# EAGLE design Physio_v1.0 (EAGLE 7.4.0)
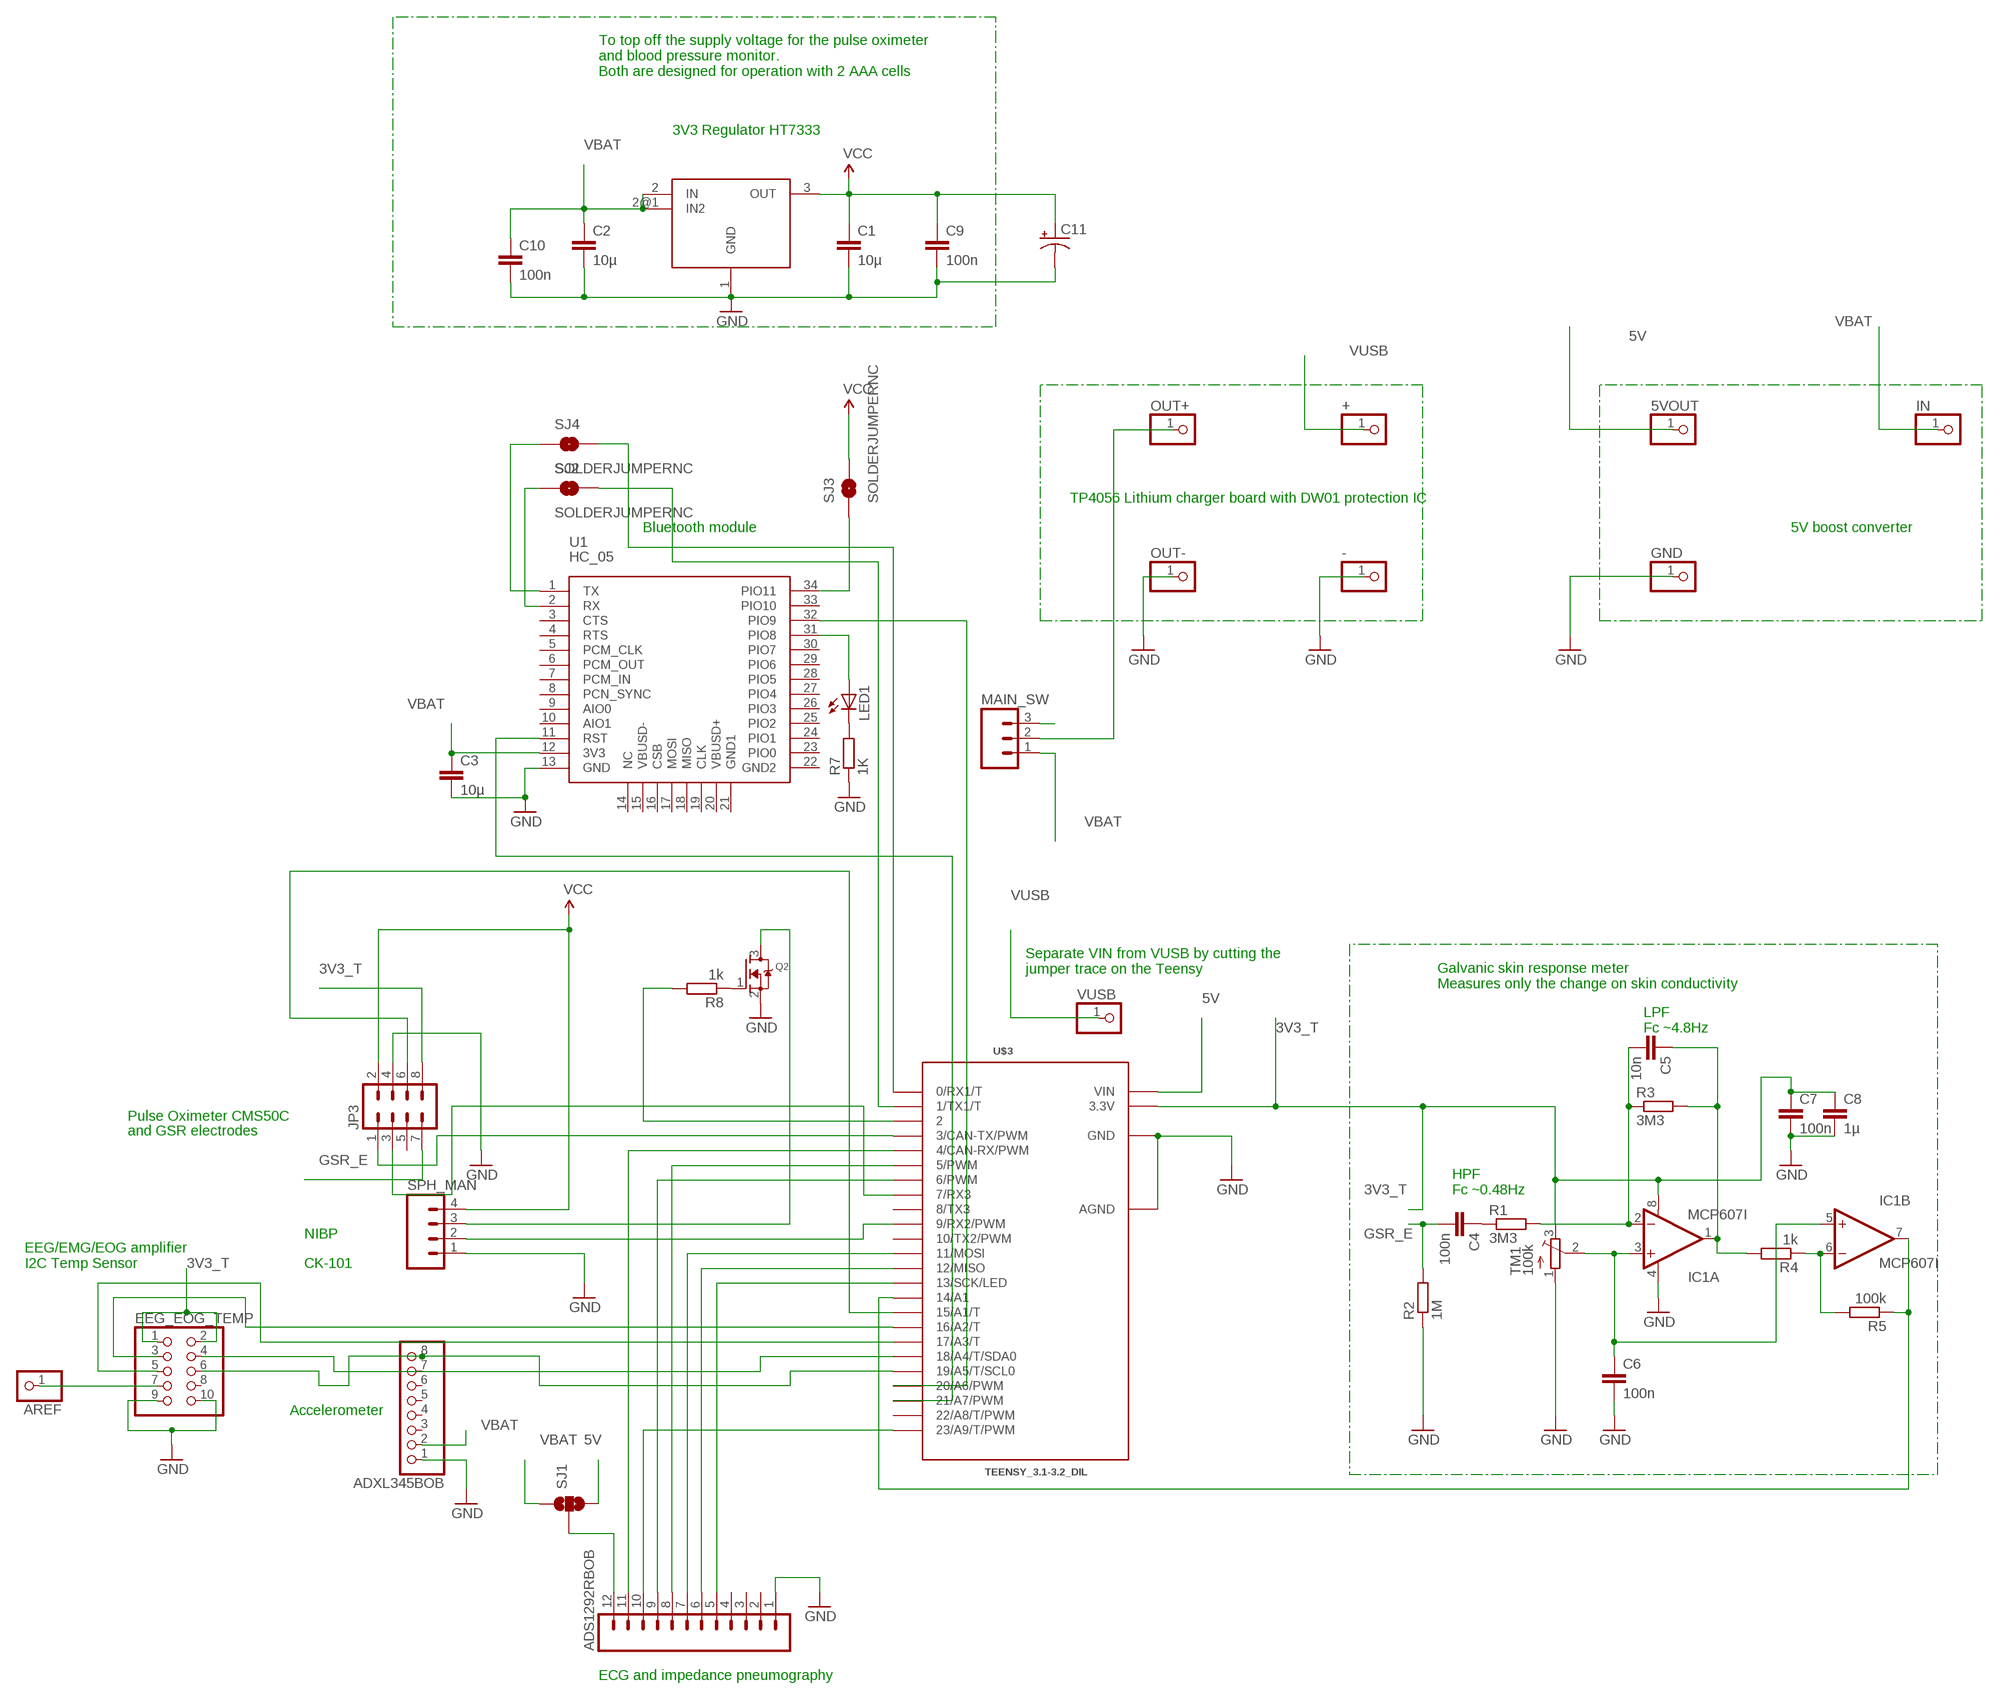
[diagram p0: schematic, sheet 1]

## Parts
5VOUT  PINHD-1X1  [1X01]
+  PINHD-1X1  [1X01]
-  PINHD-1X1  [1X01]
ADS1292RBOB  M12PTH  [1X12]
ADXL345BOB  PINHD-1X8CLEANBIG  [1X08-CLEANBIG]
AREF  PINHD-1X1  [1X01]
C1  10µ  C-EUC0805K  [C0805K]
C2  10µ  C-EUC0805K  [C0805K]
C3  10µ  C-EUC0805K  [C0805K]
C4  100n  C-EUC0603K  [C0603K]
C5  10n  C-EUC0603K  [C0603K]
C6  100n  C-EUC0603K  [C0603K]
C7  100n  C-EUC0603K  [C0603K]
C8  1µ  C-EUC0603K  [C0603K]
C9  100n  C-EUC0603K  [C0603K]
C10  100n  C-EUC0603K  [C0603K]
C11  CAP_POL7343  [EIA7343]
EEG_EOG_TEMP  PINHD-2X5/90  [2X05/90]
GND  PINHD-1X1  [1X01]
IC1  MCP607I  OPAMP-DUALU  [SO08]
IN  PINHD-1X1  [1X01]
JP3  M04X2  [2X4]
LED1  LEDCHIP-LED0805  [CHIP-LED0805]
MAIN_SW  M03PTH  [1X03]
OUT+  PINHD-1X1  [1X01]
OUT-  PINHD-1X1  [1X01]
Q2  MOSFET-NREFLOW  [SOT23]
R1  3M3  R-EU_R0603  [R0603]
R2  1M  R-EU_R0603  [R0603]
R3  3M3  R-EU_R0603  [R0603]
R4  1k  R-EU_R0603  [R0603]
R5  100k  R-EU_R0603  [R0603]
R7  1K  R-EU_R0603  [R0603]
R8  1k  R-EU_R0603  [R0603]
SJ1  SOLDERJUMPER_2WAY-OLDT  [SJ_2]
SJ2  SOLDERJUMPERNC  [SJ_2S]
SJ3  SOLDERJUMPERNC  [SJ_2S]
SJ4  SOLDERJUMPERNC  [SJ_2S]
SPH_MAN  M04PTH  [1X04]
TM1  100k  TRIMPOTTC33X  [TC33X]
U1  HC_05  [BLUETOOTH_SMD]
U$2  HT7333  [SOT89]
U$3  TEENSY_3.1-3.2_DIL  [TEENSY_3.0-3.2&LC_DIL]
VUSB  PINHD-1X1  [1X01]

## Nets
3V3_T: C7.1 C8.1 EEG_EOG_TEMP.1 EEG_EOG_TEMP.2 IC1.8(A:V+) JP3.8 TM1.3(E) U$3.3.3V
5V: 5VOUT.1 SJ1.3 U$3.VIN
GND: -.1 ADS1292RBOB.1 ADXL345BOB.1 C1.2 C2.2 C3.2 C6.2 C7.2 C8.2 C9.2 C10.2 C11.C(-) EEG_EOG_TEMP.9 EEG_EOG_TEMP.10 GND.1 IC1.4(A:V-) JP3.4 OUT-.1 Q2.2(S) R2.1 R7.1 SPH_MAN.1 TM1.1(A) U1.13(GND) U$2.1(GND) U$3.AGND U$3.GND
GSR_E: C4.2 JP3.7 R2.2
N$1: JP3.1 U$3.3(3/CAN-TX/PWM)
N$2: SPH_MAN.2 U$3.9(9/RX2/PWM)
N$3: JP3.3 U$3.7(7/RX3)
N$4: Q2.3(D) SPH_MAN.3
N$5: SJ4.2 U$3.0(0/RX1/T)
N$6: SJ2.2 U$3.1(1/TX1/T)
N$7: MAIN_SW.3
N$8: ADS1292RBOB.7 U$3.11(11/MOSI)
N$9: ADS1292RBOB.6 U$3.12(12/MISO)
N$10: ADS1292RBOB.5 U$3.13(13/SCK/LED)
N$11: ADS1292RBOB.9 U$3.6(6/PWM)
N$12: ADS1292RBOB.8 U$3.5(5/PWM)
N$13: ADS1292RBOB.11 U$3.4(4/CAN-RX/PWM)
N$14: ADS1292RBOB.10 U$3.23/A9(23/A9/T/PWM)
N$15: C5.2 IC1.2(A:-IN) R1.2 R3.1
N$16: C5.1 IC1.1(A:OUT) R3.2 R4.2
N$17: C6.1 IC1.3(A:+IN) IC1.5(B:+IN) TM1.2(S)
N$18: C4.1 R1.1
N$19: SJ4.1 U1.1(TX)
N$20: IC1.6(B:-IN) R4.1 R5.2
N$21: IC1.7(B:OUT) R5.1 U$3.14/A0(14/A1)
N$22: SJ2.1 U1.2(RX)
N$23: JP3.6 U$3.15/A1(15/A1/T)
N$25: ADXL345BOB.8 EEG_EOG_TEMP.6 U$3.19/A5(19/A5/T/SCL0)
N$26: ADXL345BOB.7 EEG_EOG_TEMP.4 U$3.18/A4(18/A4/T/SDA0)
N$27: LED1.C R7.2
N$28: LED1.A U1.31(PIO8)
N$29: EEG_EOG_TEMP.3 U$3.16/A2(16/A2/T)
N$30: EEG_EOG_TEMP.5 U$3.17/A3(17/A3/T)
N$31: R8.2 U$3.2
N$33: ADS1292RBOB.12 SJ1.2
N$36: Q2.1(G) R8.1
N$37: AREF.1 EEG_EOG_TEMP.7
N$38: MAIN_SW.2 OUT+.1
N$39: U1.32(PIO9) U$3.20/A6(20/A6/PWM)
N$40: U1.11(RST) U$3.21/A7(21/A7/PWM)
N$41: SJ3.1 U1.34(PIO11)
VBAT: ADXL345BOB.2 C2.1 C3.1 C10.1 IN.1 MAIN_SW.1 SJ1.1 U1.12(3V3) U$2.2(IN) U$2.2@1(IN2)
VCC: C1.1 C9.1 C11.A(+) JP3.2 SJ3.2 SPH_MAN.4 U$2.3(OUT)
VUSB: +.1 VUSB.1
Unconnected: ADS1292RBOB.2 ADS1292RBOB.3 ADS1292RBOB.4 ADXL345BOB.3 ADXL345BOB.4 ADXL345BOB.5 ADXL345BOB.6 EEG_EOG_TEMP.8 JP3.5 U1.3(CTS) U1.4(RTS) U1.5(PCM_CLK) U1.6(PCM_OUT) U1.7(PCM_IN) U1.8(PCN_SYNC) U1.9(AIO0) U1.10(AIO1) U1.14(NC) U1.15(VBUSD-) U1.16(CSB) U1.17(MOSI) U1.18(MISO) U1.19(CLK) U1.20(VBUSD+) U1.21(GND1) U1.22(GND2) U1.23(PIO0) U1.24(PIO1) U1.25(PIO2) U1.26(PIO3) U1.27(PIO4) U1.28(PIO5) U1.29(PIO6) U1.30(PIO7) U1.33(PIO10) U$3.8(8/TX3) U$3.10(10/TX2/PWM) U$3.22/A8(22/A8/T/PWM)

## Notes on the sheet
- To top off the supply voltage for the pulse oximeter 
  and blood pressure monitor. 
  Both are designed for operation with 2 AAA cells
- 3V3 Regulator HT7333
- TP4056 Lithium charger board with DW01 protection IC
- Bluetooth module | 5V boost converter
- Separate VIN from VUSB by cutting the 
  jumper trace on the Teensy
- Galvanic skin response meter
  Measures only the change on skin conductivity
- LPF
  Fc ~4.8Hz
- Pulse Oximeter CMS50C
- and GSR electrodes
- HPF
  Fc ~0.48Hz
- NIBP
- EEG/EMG/EOG amplifier
  I2C Temp Sensor
- CK-101
- Accelerometer
- ECG and impedance pneumography

## Library data of the parts
5VOUT + - GND IN OUT+ OUT- VUSB = adafruit:PINHD-1X1: Pin header 1x1 for 0.1" spacing With round pins
ADS1292RBOB = SparkFun-Connectors:M12: Header 12 Standard 12-pin 0.1" header. Use with straight break away headers (SKU : PRT-00116), right angle break away headers (PRT-00553), swiss pins (PRT-00743), machine pins (PRT-00117), and female headers (PRT-00115).
ADXL345BOB = adafruit:PINHD-1X8: PIN HEADER
AREF = pinhead:PINHD-1X1: PIN HEADER
C1-C10 = rcl:C-EU: CAPACITOR, European symbol
C11 = SparkFun-Passives:CAP_POL: Capacitor Polarized These are standard SMD and PTH capacitors. Normally 10uF, 47uF, and 100uF in electrolytic and tantalum varieties. Always verify the external diameter of the through hole cap, it varies with capacity, voltage, and manufacturer. The EIA devices should be standard.
EEG_EOG_TEMP = pinhead:PINHD-2X5: PIN HEADER
IC1 = SparkFun-AnalogIC:OPAMP-DUAL: Generic op-amp footprint
JP3 = SparkFun-Connectors:M04X2: .1" header, two rows of four.
LED1 = adafruit:LED: LED OSRAM: - CHIPLED LG R971, LG N971, LY N971, LG Q971, LY Q971, LO R971, LY R971 LH N974, LH R974 LS Q976, LO Q976, LY Q976 LO Q996 - Hyper CHIPLED LW Q18S LB Q993, LB Q99A, LB R99A - SideLED LS A670, LO A670, LY A670, LG A670, LP A670 LB A673, LV A673, LT A673, LW A673 LH A674 LY A675 LS A676, LA A676, LO A676, LY A676, LW A676 LS A679, LY A679, LG A679 - Hyper Micro SIDELED® LS Y876, LA Y876, LO Y876, LY Y876 LT Y87S - SmartLED LW L88C, LW L88S LB L89C, LB L89S, LG L890 LS L89K, LO L89K, LY L89K LS L896, LA L896, LO L896, LY L896 - TOPLED LS T670, LO T670, LY T670, LG T670, LP T670 LSG T670, LSP T670, LSY T670, LOP T670, LYG T670 LG T671, LOG T671, LSG T671 LB T673, LV T673, LT T673, LW T673 LH T674 LS T676, LA T676, LO T676, LY T676, LB T676, LH T676, LSB T676, LW T676 LB T67C, LV T67C, LT T67C, LS T67K, LO T67K, LY T67K, LW E67C LS E67B, LA E67B, LO E67B, LY E67B, LB E67C, LV E67C, LT E67C LW T67C LS T679, LY T679, LG T679 LS T770, LO T770, LY T770, LG T770, LP T770 LB T773, LV T773, LT T773, LW T773 LH T774 LS E675, LA E675, LY E675, LS T675 LS T776, LA T776, LO T776, LY T776, LB T776 LHGB T686 LT T68C, LB T68C - Hyper Mini TOPLED® LB M676 - Mini TOPLED Santana® LG M470 LS M47K, LO M47K, LY M47K Source: http://www.osram.convergy.de/
MAIN_SW = SparkFun-Connectors:M03: Header 3 Standard 3-pin 0.1" header. Use with straight break away headers (SKU : PRT-00116), right angle break away headers (PRT-00553), swiss pins (PRT-00743), machine pins (PRT-00117), and female headers (PRT-00115). Molex polarized connector foot print use with SKU : PRT-08232 with associated crimp pins and housings.
Q2 = adafruit:MOSFET-N: N-Channel Mosfet 2N7002E - 60V 260mA SOT23 [Digikey: 2N7002ET1GOSTR-ND] - REEL BSH103 - 30V 850mA SOT23 [Digikey: 568-5013-1-ND]
R1-R5 R7 R8 = rcl:R-EU_: RESISTOR, European symbol
SJ1 = SparkFun-Retired:SOLDERJUMPER_2WAY-OLD: Solder Jumper 2 way solder jumper
SJ2-SJ4 = SparkFun-Retired:SOLDERJUMPER: Solder Jumper Standard SMD solder jumper. Used to automate production. Two varients : Normally Open and Normally Closed are the same, but have different paste layers. NC will have a large amount of paste and should jumper during reflow.
SPH_MAN = SparkFun-Connectors:M04: Header 4 Standard 4-pin 0.1" header. Use with straight break away headers (SKU : PRT-00116), right angle break away headers (PRT-00553), swiss pins (PRT-00743), machine pins (PRT-00117), and female headers (PRT-00115). Molex polarized connector foot print use with SKU : PRT-08231 with associated crimp pins and housings. 1MM SMD Version SKU: PRT-10208
TM1 = adafruit:TRIMPOT: SMT trimmer potentiometer part number TC33X http://www.ladyada.net/library/eagle
U1 = Bluetooth HC-05:HC_05: HC-05 Bluetooth Module
U$2 = HT7333:HT7333
U$3 = Teensy_3_and_LC_Series_Boards_v1.4:TEENSY_3.1-3.2_DIL: Teensy 3.1 or 3.2 in a DIL Layout.

## Board
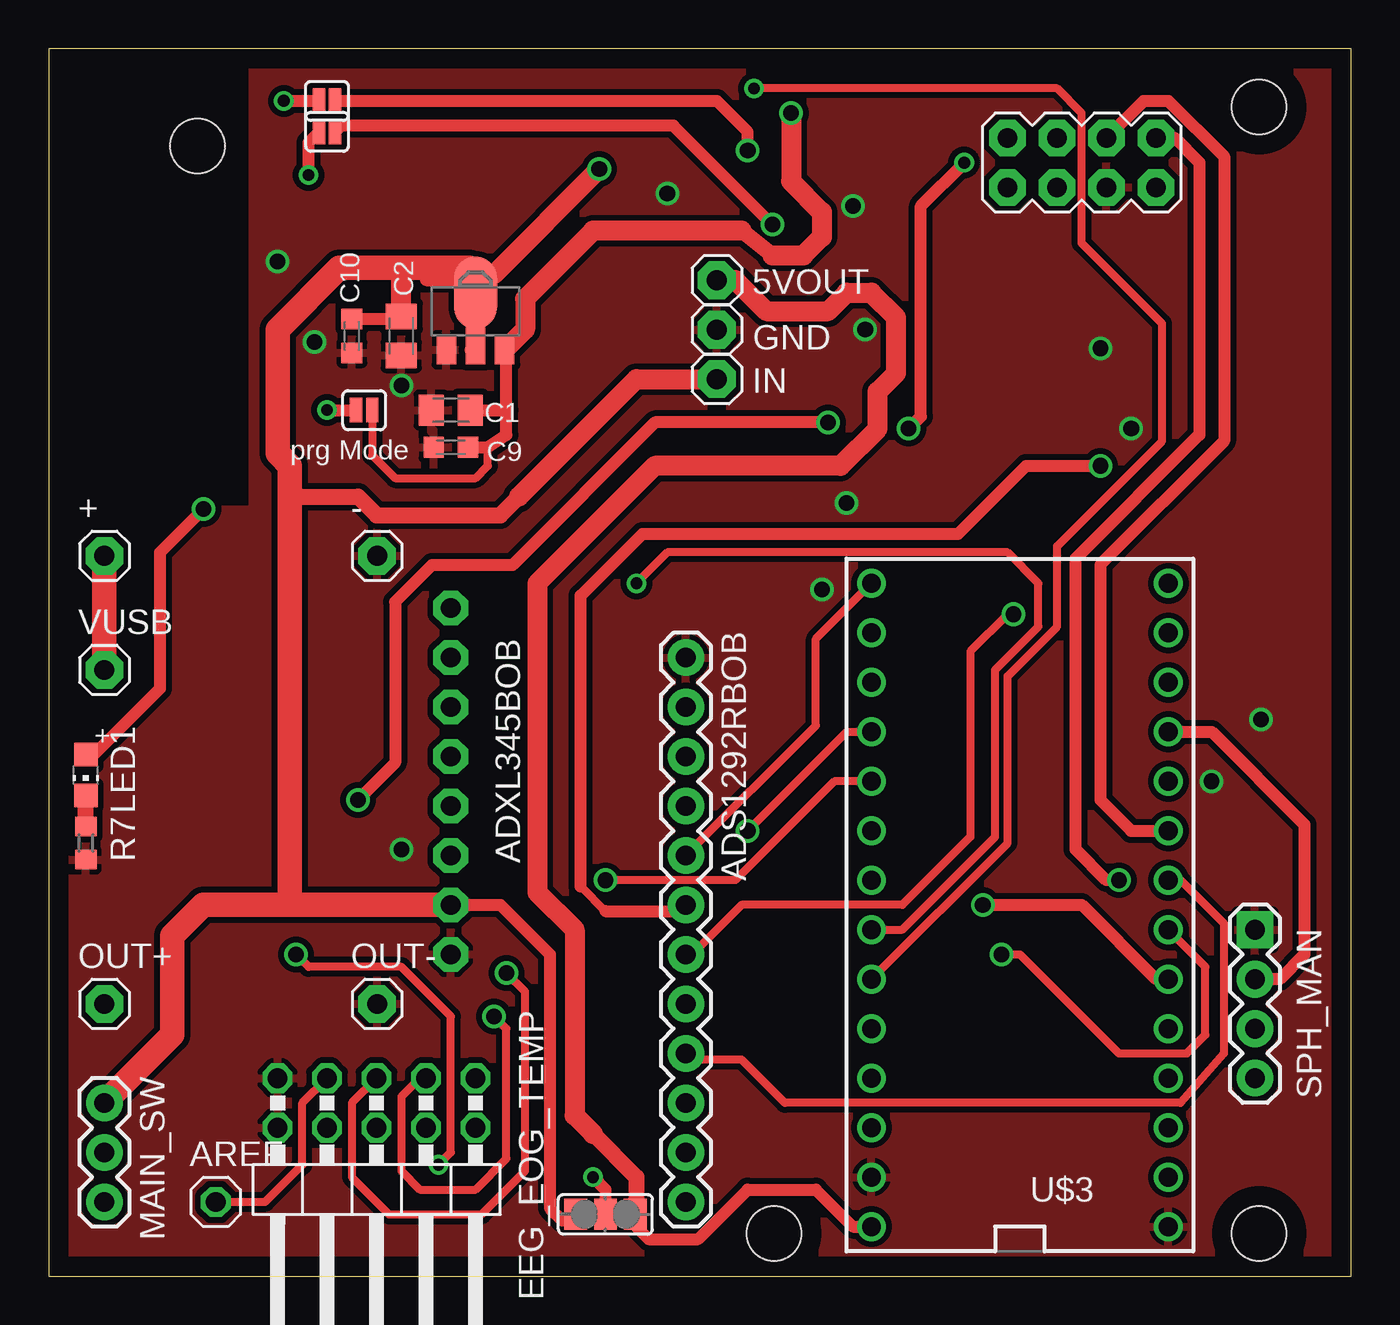
[diagram p1: board, top side]
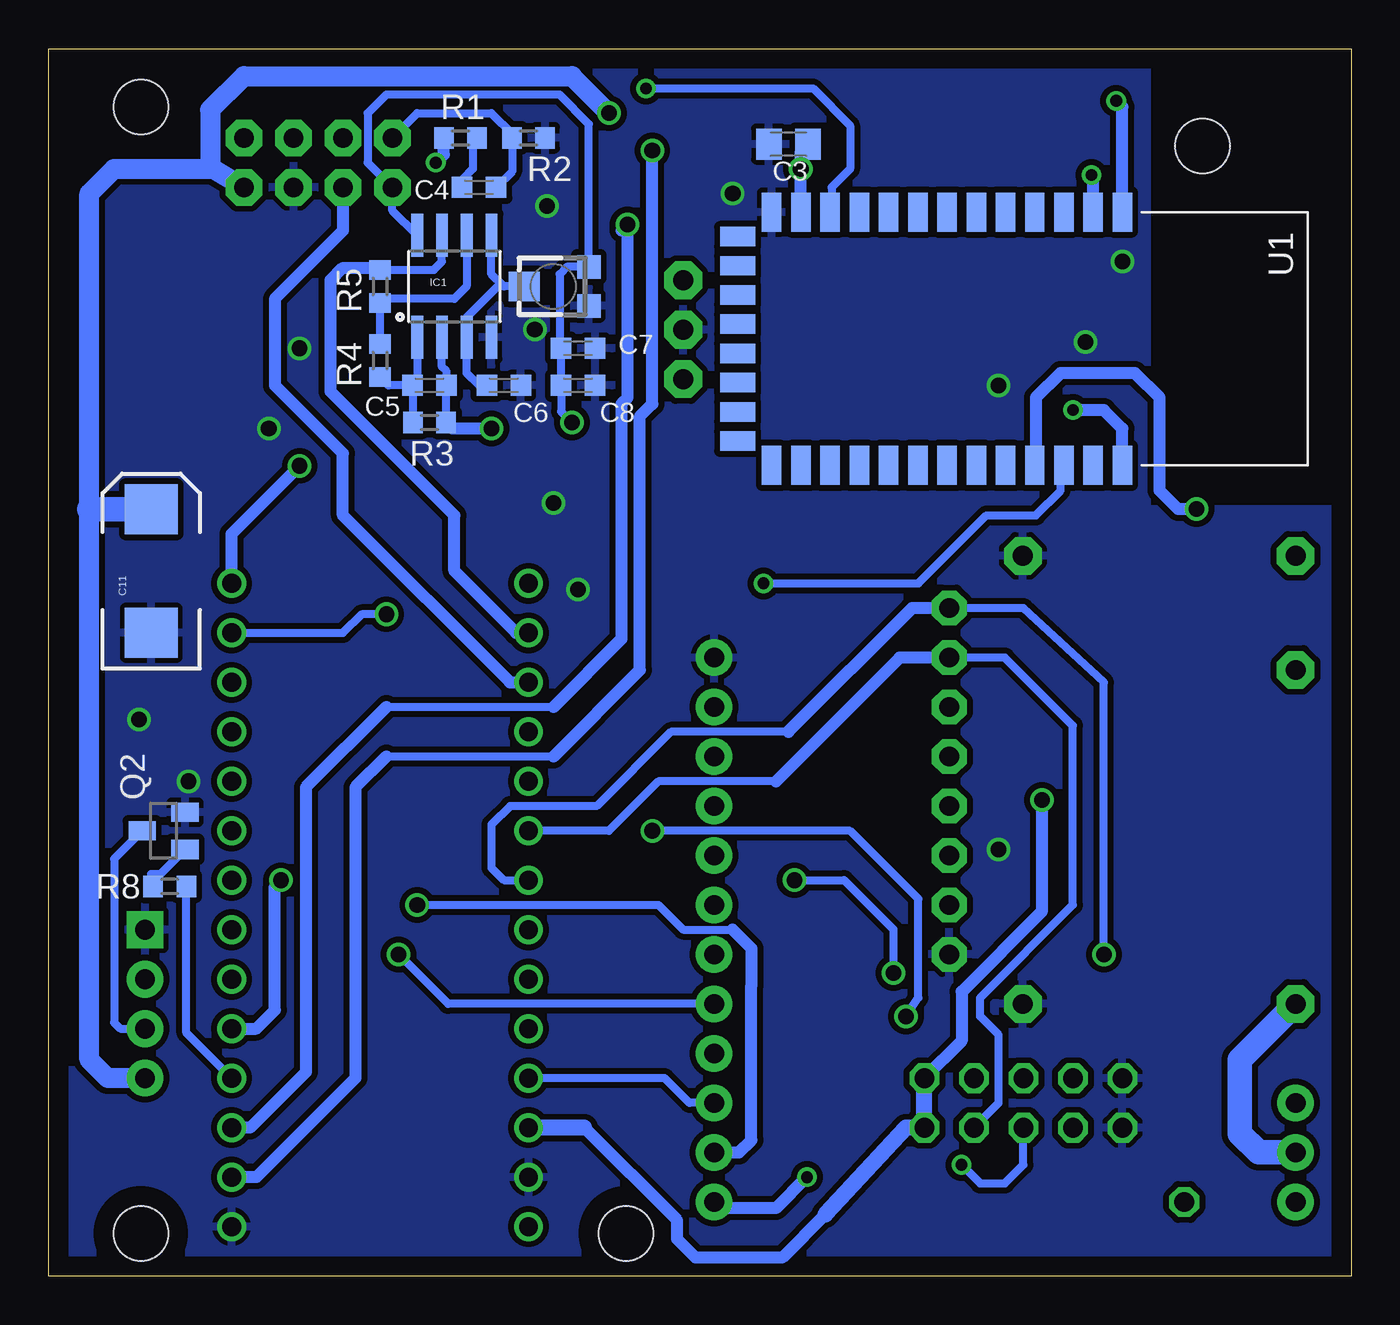
[diagram p2: board, bottom side, seen from below]

Size 66.86 x 63 mm. Coordinates in mm from the lower left corner, seen from the top.
Outline: 0,0 66.86,0 66.86,63 0,63 0,0
Copper layers (1*16): Top 0.035mm / dielectric 1.5mm / Bottom 0.035mm
Design rules "default": minimum track width 10mil, minimum drill 24mil, track to track 8mil, track to pad 8mil, pad to pad 8mil, via to via 8mil, smd to smd 8mil, copper to edge 40mil, drill to drill 8mil, minimum pad ring 10mil, minimum via ring 8mil, stop-mask expansion 4mil, vias tented up to drill 0mil, thermal gap 10mil
Holes 2.8 mm at 7.63,58 62.13,60 62.13,2.2 37.23,2.2

### Footprints (pad centres in the part's own frame; a part is rotated, then mirrored left to right if it is on the bottom)
1X01 = drill 1.016 pad 1.93 octagon: 1 0,0
1X12 = drill 1.016 pad 1.88: 1 0,0; 2 2.54,0; 3 5.08,0; 4 7.62,0; 5 10.16,0; 6 12.7,0; 7 15.24,0; 8 17.78,0; 9 20.32,0; 10 22.86,0; 11 25.4,0; 12 27.94,0
1X08-CLEANBIG = drill 1.016 pad 1.778 octagon: 1 -8.89,0; 2 -6.35,0; 3 -3.81,0; 4 -1.27,0; 5 1.27,0; 6 3.81,0; 7 6.35,0; 8 8.89,0
1X01' = drill 1.016 octagon: 1 0,0
C0805K = smd 1.3 x 1.6: 1 -1,0; 2 1,0
C0603K = smd 1.05 x 1.08: 1 -0.875,0; 2 0.875,0
EIA7343 = smd 2.55 x 2.7: A 3.17,0; C -3.17,0
2X05/90 = drill 1.016 octagon: 1 -5.08,-6.35; 2 -5.08,-3.81; 3 -2.54,-6.35; 4 -2.54,-3.81; 5 0,-6.35; 6 0,-3.81; 7 2.54,-6.35; 8 2.54,-3.81; 9 5.08,-6.35; 10 5.08,-3.81
SO08 = smd 0.61 x 2.21: 1 -1.905,-2.616; 2 -0.635,-2.616; 3 0.635,-2.616; 4 1.905,-2.616; 5 1.905,2.616; 6 0.635,2.616; 7 -0.635,2.616; 8 -1.905,2.616
2X4 = drill 1.016 pad 1.88 octagon: 1 -3.81,-1.27; 2 -3.81,1.27; 3 -1.27,-1.27; 4 -1.27,1.27; 5 1.27,-1.27; 6 1.27,1.27; 7 3.81,-1.27; 8 3.81,1.27
CHIP-LED0805 = smd 1.2 x 1.2: A 0,-1.05; C 0,1.05
1X03 = drill 1.016 pad 1.88: 1 0,0; 2 2.54,0; 3 5.08,0
SOT23 = smd 1 x 1.4: 1 -0.95,-1.1; 2 0.95,-1.1; 3 0,1.1
R0603 = smd 1 x 1.1: 1 -0.85,0; 2 0.85,0
SJ_2 = smd 1.168 x 1.6: 1 -1.524,0; 2 0,0; 3 1.524,0
SJ_2S = smd 0.635 x 1.27: 1 -0.412,0; 2 0.412,0
1X04 = drill 1.016 pad 1.88 square: 1 0,0 | drill 1.016 pad 1.88: 2 2.54,0; 3 5.08,0; 4 7.62,0
TC33X = smd 1.2 x 1.2: 1 -1,-1.825; 3 1,-1.825 | smd 1.5 x 1.6: 2 0,1.5
BLUETOOTH_SMD = smd 2 x 1: 1 -6.35,3.81; 2 -6.35,2.31; 3 -6.35,0.81; 4 -6.35,-0.69; 5 -6.35,-2.19; 6 -6.35,-3.69; 7 -6.35,-5.19; 8 -6.35,-6.69; 9 -6.35,-8.19; 10 -6.35,-9.69; 11 -6.35,-11.19; 12 -6.35,-12.69; 13 -6.35,-14.19; 22 6.65,-14.19; 23 6.65,-12.69; 24 6.65,-11.19; 25 6.65,-9.69; 26 6.65,-8.19; 27 6.65,-6.69; 28 6.65,-5.19; 29 6.65,-3.69; 30 6.65,-2.19; 31 6.65,-0.69; 32 6.65,0.81; 33 6.65,2.31; 34 6.65,3.81 | smd 1 x 1.8: 14 -5.1,-15.94; 15 -3.6,-15.94; 16 -2.1,-15.94; 17 -0.6,-15.94; 18 0.9,-15.94; 19 2.4,-15.94; 20 3.9,-15.94; 21 5.4,-15.94
SOT89 = smd 1 x 1.5: 1 -1.499,-1.981; 3 1.499,-1.981 | smd 1 x 2: 2 0,-1.727 | smd 2.2 x 3.7: 2@1 0,0.94
TEENSY_3.0-3.2&LC_DIL = drill 0.965: 0 -7.62,13.97; 1 -7.62,11.43; 2 -7.62,8.89; 3 -7.62,6.35; 3.3V 7.62,11.43; 4 -7.62,3.81; 5 -7.62,1.27; 6 -7.62,-1.27; 7 -7.62,-3.81; 8 -7.62,-6.35; 9 -7.62,-8.89; 10 -7.62,-11.43; 11 -7.62,-13.97; 12 -7.62,-16.51; 13 7.62,-16.51; 14/A0 7.62,-13.97; 15/A1 7.62,-11.43; 16/A2 7.62,-8.89; 17/A3 7.62,-6.35; 18/A4 7.62,-3.81; 19/A5 7.62,-1.27; 20/A6 7.62,1.27; 21/A7 7.62,3.81; 22/A8 7.62,6.35; 23/A9 7.62,8.89; AGND 7.62,13.97; GND -7.62,16.51; VIN 7.62,16.51

### Placement (x,y rotation side)
5VOUT  34.29,51.12 0 top
+  2.86,36.97 0 top
-  16.86,36.97 0 top
ADS1292RBOB  32.7,31.75 270 top
ADXL345BOB  20.64,25.4 90 top
AREF  [1X01']  8.57,3.81 0 top
C1  20.64,44.45 180 top
C2  18.1,48.26 270 top
C3  28.89,58.1 180 bottom
C4  44.77,55.88 0 bottom
C5  47.31,45.72 0 bottom
C6  43.5,45.72 0 bottom
C7  39.69,47.62 0 bottom
C8  39.69,45.72 0 bottom
C9  20.64,42.55 180 top
C10  15.56,48.26 270 top
C11  61.6,36.2 90 bottom
EEG_EOG_TEMP  16.83,3.81 180 top
GND  34.29,48.58 0 top
IC1  46.04,50.8 0 bottom
IN  34.29,46.04 0 top
JP3  53.02,57.15 180 top
LED1  1.9,25.72 180 top
MAIN_SW  2.86,8.89 270 top
OUT+  2.86,13.97 0 top
OUT-  16.86,13.97 0 top
Q2  60.96,22.86 90 bottom
R1  45.72,58.42 180 bottom
R2  42.23,58.42 180 bottom
R3  47.31,43.81 180 bottom
R4  49.85,46.99 270 bottom
R5  49.85,50.8 270 bottom
R7  1.9,22.23 90 top
R8  60.64,20 0 bottom
SJ1  28.57,3.17 0 top
SJ2  14.29,58.74 0 top
SJ3  16.19,44.45 0 top
SJ4  14.29,60.33 0 top
SPH_MAN  61.91,17.78 270 top
TM1  40.96,50.8 90 bottom
U1  15.56,48.26 270 bottom
U$2  21.91,49.53 0 top
U$3  49.85,19.05 180 top
VUSB  2.86,31.11 0 top

### Tracks (layer width: path | path; a pad name or v marks a point on that pad's centre or on a via)
3V3_T  (via drill 0.8 pad 0.25)
  Top 0.61: v40.01,43.81 31.11,43.81 23.81,36.51 19.68,36.51 17.78,34.61 17.78,26.35 v15.87,24.45
  Bottom 0.406: v40.01,43.81 40.56,44.37 C8.1 C7.1 40.64,47.7 40.64,51.44 40.28,51.8 TM1.3 39.13,59.13 40.64,60.64 49.53,60.64 50.48,59.69 50.48,57.15 JP3.8 49.21,54.69 IC1.8
  Bottom 0.61: v15.87,24.45 15.87,18.73 20,14.61 20,12.06 EEG_EOG_TEMP.1 | 26.99,3.17 29.21,0.95 33.65,0.95 34.61,1.91 34.61,2.86 39.37,7.62
  Bottom 0.813: EEG_EOG_TEMP.1 EEG_EOG_TEMP.2 22.86,7.62 26.99,3.17 | 39.37,7.62 U$3.3.3V
5V
  Top 0.61: U$3.VIN 41.28,2.54 39.37,4.45 35.88,4.45 33.34,1.91 30.8,1.91 30.16,2.54 30.16,3.24
  Top 0.813: 27.94,7.3 30.16,5.08 30.16,3.24 SJ1.3
  Top 1.016: 27.94,7.3 26.99,8.26 26.99,17.78 25.08,19.68 25.08,35.56 31.11,41.59 40.64,41.59 42.54,43.5 42.54,45.4 43.5,46.35 43.5,49.21 42.23,50.48 40.96,50.48 40.01,49.53 36.83,49.53 35.24,51.12 5VOUT.1
GND  (via drill 0.8 pad 0.25)
  other vias: 31.75,55.56 41.28,54.93 40.96,39.69 18.1,21.91 41.91,48.58 53.98,47.62 59.69,25.4 62.23,28.57 11.75,52.07 39.69,35.24 55.56,43.5 18.1,45.72 13.65,47.94
  pour Top (isolate 0.305): -3.49,39.37 10.48,39.37 10.48,66.04 70.17,66.04 70.17,-2.54 -3.49,-2.54
  pour Bottom (isolate 0.305): 10.48,64.77 68.9,64.77 68.9,-1.27 -0.95,-1.27 -0.95,0 -0.95,39.37 10.48,39.37
GSR_E
  Bottom 0.406: C4.2 43.08,56.7 R2.2 43.08,58.63 44.13,59.69 47.94,59.69 JP3.7
N$1  (via drill 0.8 pad 0.25)
  Top 0.61: v54.93,20.32 54.29,20.32 52.71,21.91 52.71,36.83 59.05,43.18 59.05,57.15 57.79,58.42 JP3.1
  Bottom 0.61: U$3.3 56.2,12.7 55.25,13.65 55.25,20 v54.93,20.32
N$2
  Top 0.61: U$3.9 59.69,27.94 64.45,23.18 64.45,16.51 63.18,15.24 SPH_MAN.2
N$3
  Top 0.61: U$3.7 55.56,22.86 53.97,24.45 53.97,36.51 60.33,42.86 60.33,57.47 57.47,60.33 56.2,60.33 JP3.3
N$4
  Bottom 0.406: Q2.3 63.5,21.42 63.5,13.02 63.18,12.7 SPH_MAN.3
N$5  (via drill 0.8 pad 0.25)
  Top 0.61: v35.88,57.78 35.88,58.74 34.29,60.33 SJ4.2
  Bottom 0.406: 40.96,26.67 49.53,26.67
  Bottom 0.61: 40.96,26.67 36.51,31.11 36.51,44.13 35.88,44.77 v35.88,57.78 | 49.53,26.67 51.12,25.08 51.12,10.16 56.2,5.08 U$3.0
N$6  (via drill 0.8 pad 0.25)
  Top 0.61: 37.15,54.29 v37.15,53.98 32.07,59.05 15.02,59.05 SJ2.2
  Bottom 0.406: 40.96,29.21 49.53,29.21
  Bottom 0.61: 40.96,29.21 37.47,32.7 37.47,44.77 37.15,45.09 v37.15,53.98 37.47,53.66 | 49.53,29.21 53.66,25.08 53.66,10.48 56.51,7.62 U$3.1
N$8  (via drill 0.8)
  Top 0.406: ADS1292RBOB.7 33.02,16.83 33.34,16.83 35.56,19.05 43.82,19.05 47.31,22.54 47.31,32.07 49.21,33.97 v49.53,33.97
  Bottom 0.406: U$3.11 51.75,33.02 50.8,33.97 v49.53,33.97
N$9  (via drill 0.8)
  Top 0.406: 27.31,20 28.58,18.73
  Top 0.61: 27.31,20 27.31,34.92 30.48,38.1 46.67,38.1 50.16,41.59 v53.97,41.59 | 28.58,18.73 32.39,18.73 ADS1292RBOB.6
  Bottom 0.61: U$3.12 57.47,38.1 v53.97,41.59
N$10
  Top 0.406: ADS1292RBOB.5 39.37,28.26 39.37,32.7 U$3.13
N$11
  Top 0.406: U$3.6 58.1,20.32 60.33,18.1 60.33,11.43 58.1,8.89 37.78,8.89 35.56,11.11 33.02,11.11 ADS1292RBOB.9
N$12  (via drill 0.8 pad 0.25)
  Top 0.406: v48.9,16.51 49.85,16.51 54.93,11.43 58.42,11.43 59.37,12.38 59.37,15.88 U$3.5
  Bottom 0.406: ADS1292RBOB.8 46.36,13.97 v48.9,16.51
N$13  (via drill 0.8 pad 0.25)
  Top 0.61: v47.94,19.05 53.02,19.05 56.83,15.24 U$3.4
  Bottom 0.406: v47.94,19.05 35.56,19.05 34.29,17.78 31.75,17.78
  Bottom 0.61: ADS1292RBOB.11 31.43,6.35 30.8,6.99 30.8,14.92 30.8,16.83 31.75,17.78
N$14
  Bottom 0.406: ADS1292RBOB.10 33.97,8.89 35.24,10.16 U$3.23/A9
N$15  (via drill 0.6, 0.8)
  Top 0.61: v44.13,43.5 44.77,44.13 44.77,54.93 v46.99,57.15
  Bottom 0.406: R3.1 46.46,45.7 C5.2 46.43,46.43 46.67,46.67 IC1.2
  Bottom 0.61: v44.13,43.5 46.14,43.5 R3.1 | v46.99,57.15 46.57,57.57 R1.2
N$16
  Bottom 0.406: IC1.1 47.94,45.96 C5.1 | C5.1 49.43,45.72 R4.2 | C5.1 48.18,43.84 R3.2
N$17
  Bottom 0.406: C6.1 44.77,45.72 45.4,46.35 IC1.3 45.4,49.21 43.82,50.8 43.5,50.8 | TM1.2 43.5,50.8 | 43.5,50.8 44.13,51.44 IC1.5
N$18
  Bottom 0.406: R1.1 45.08,58.2 45.08,56.83 45.64,56.27 C4.1
N$19  (via drill 0.6)
  Top 0.61: v12.07,60.33 SJ4.1
  Bottom 0.61: U1.1 11.75,60.01 v12.07,60.33
N$20
  Bottom 0.406: R4.1 R5.2 49.63,50.16 46.04,50.16 45.4,50.8 IC1.6
N$21
  Bottom 0.406: R5.1 47.09,51.65 46.67,52.07 IC1.7
  Bottom 0.61: U$3.14/A0 42.86,33.02 46.04,36.2 46.04,39.05 52.39,45.4 52.39,51.12 51.75,51.75 49.95,51.75 R5.1
N$22  (via drill 0.6)
  Top 0.61: v13.34,56.52 13.34,58.2 SJ2.1
  Bottom 0.61: U1.2 13.25,56.43 v13.34,56.52
N$23
  Bottom 0.61: U$3.15/A1 43.18,30.48 51.75,39.05 51.75,42.23 55.25,45.72 55.25,50.16 51.75,53.66 JP3.6
N$25  (via drill 0.6, 0.8 pad 0.25)
  Top 0.406: v12.7,16.51 13.34,15.88 18.1,15.88 20.64,13.34 20.64,6.35 v20,5.71
  Bottom 0.406: 28.89,27.94 34.93,27.94 38.73,24.13 43.18,24.13 44.13,23.18 44.13,20.95 43.5,20.32 U$3.19/A5 | v12.7,16.51 12.7,30.48 16.83,34.29 ADXL345BOB.8 | EEG_EOG_TEMP.6 16.83,5.71 17.78,4.76 19.05,4.76 v20,5.71
  Bottom 0.61: ADXL345BOB.8 22.54,34.29 28.89,27.94
N$26
  Bottom 0.406: 29.53,25.4 35.56,25.4 38.1,22.86 U$3.18/A4 | ADXL345BOB.7 17.78,31.75 14.29,28.26 14.29,19.05 19.05,14.29 19.05,13.34 18.1,12.38 18.1,8.89 EEG_EOG_TEMP.4
  Bottom 0.61: ADXL345BOB.7 23.18,31.75 29.53,25.4
N$27
  Top 0.813: R7.2 LED1.C
N$28  (via drill 0.8 pad 0.25)
  Top 0.61: v7.94,39.37 5.71,37.15 5.71,30.16 2.32,26.77 LED1.A
  Bottom 0.61: U1.31 16.19,41.66 16.19,45.09 14.92,46.35 11.11,46.35 9.84,45.09 9.84,40.32 8.89,39.37 v7.94,39.37
N$29  (via drill 0.8 pad 0.25)
  Top 0.406: EEG_EOG_TEMP.3 19.05,10.16 18.1,9.21 18.1,5.4 19.05,4.45 21.91,4.45 23.49,6.03 23.49,12.7 v22.86,13.34 | v35.88,22.86 40.96,27.94 U$3.16/A2
  Bottom 0.406: v22.86,13.34 22.22,14.29 22.22,19.37 25.72,22.86 v35.88,22.86
N$30  (via drill 0.8 pad 0.25)
  Top 0.406: U$3.17/A3 40.32,25.4 35.24,20.32 v28.58,20.32 | EEG_EOG_TEMP.5 15.56,8.89 15.56,5.08 17.46,3.17 22.22,3.17 24.45,5.4 24.45,14.61 v23.49,15.56
  Bottom 0.406: v23.49,15.56 23.49,17.78 26.04,20.32 v28.58,20.32
N$31
  Bottom 0.406: U$3.2 59.79,12.48 R8.2
N$33  (via drill 0.6)
  Top 0.61: v27.94,5.08 28.58,4.45 SJ1.2
  Bottom 0.61: v27.94,5.08 29.53,3.49 32.39,3.49 ADS1292RBOB.12
N$36
  Bottom 0.406: Q2.1 61.13,20.64 61.6,20.64 61.49,20.54 R8.1
N$37
  Top 0.406: AREF.1 11.11,3.81 13.02,5.71 13.02,8.89 EEG_EOG_TEMP.7
N$38
  Bottom 1.27: MAIN_SW.2 4.76,6.35 5.71,7.3 5.71,11.11 OUT+.1
N$39  (via drill 0.6)
  Top 0.406: U$3.20/A6 43.82,17.78 48.58,22.54 48.58,31.11 50.8,33.34 50.8,35.56 49.21,37.15 31.75,37.15 v30.16,35.56
  Bottom 0.406: v30.16,35.56 22.22,35.56 18.73,39.05 16.19,39.05 14.92,40.32 14.92,41.44 U1.32
N$40  (via drill 0.6)
  Top 0.406: U$3.21/A7 49.21,22.23 49.21,30.8 51.75,33.34 51.75,37.47 57.15,42.86 57.15,48.9 53.02,53.02 53.02,59.69 51.75,60.96 v36.19,60.96
  Bottom 0.406: v36.19,60.96 27.62,60.96 25.72,59.05 25.72,56.83 26.67,55.88 26.67,54.69 U1.11
N$41  (via drill 0.6)
  Top 0.61: v14.29,44.45 SJ3.1
  Bottom 0.61: U1.34 11.75,43.5 12.7,44.45 v14.29,44.45
VBAT  (via drill 0.8 pad 0.25)
  Top 0.406: U$2.2 U$2.2@1
  Top 0.61: 19.37,51.12 21.26,51.12 U$2.2@1 | C10.1 17.97,49.13 C2.1 | 21.64,47.53 U$2.2 | ADXL345BOB.2 23.18,19.05 25.72,16.51 25.72,3.49 26.35,2.86 26.73,2.86 SJ1.1
  Top 0.813: 12.7,40.01 15.87,40.01 16.83,39.05 23.18,39.05 24.13,40.01
  Top 1.016: 24.13,40.01 30.16,46.04 IN.1 | 12.7,40.01 12.38,40.32 | 21.91,51.44 22.86,51.44 v28.26,56.83 | C2.1 18.1,51.75
  Top 1.27: 12.38,19.05 ADXL345BOB.2 | U$2.2@1 21.91,51.44 21.59,51.75 18.1,51.75 14.92,51.75 11.75,48.58 11.75,42.23 12.38,41.59 12.38,40.32 12.38,19.05 | MAIN_SW.1 6.35,12.38 6.35,17.46 7.94,19.05 12.38,19.05
  Bottom 0.406: v28.26,56.83 28.26,57.74 C3.1
  Bottom 0.61: U1.12 28.25,57.75 C3.1
VCC  (via drill 0.8 pad 0.25)
  Top 0.406: SJ3.2 16.6,42.13 17.78,40.96 21.91,40.96 22.54,41.59 22.54,42.55
  Top 0.61: C9.1 22.54,42.55 23.49,43.18 23.49,44.45 | 23.49,44.45 23.49,47.46 U$2.3 | C1.1 23.49,44.45
  Top 0.813: 35.56,53.66 37.15,52.39
  Top 1.016: 35.56,53.66 27.94,53.66 24.45,50.16 24.45,48.59 U$2.3 | v38.1,59.69 38.1,56.2 39.69,54.61 39.69,53.34 38.73,52.39 37.15,52.39
  Bottom 1.016: SPH_MAN.4 63.82,10.16 64.77,11.11 64.77,39.37 64.77,55.56 63.5,56.83 58.42,56.83 | v38.1,59.69 40.01,61.59 56.83,61.59 58.57,59.86 58.57,56.98 58.42,56.83 | 58.42,56.83 JP3.2
  Bottom 1.27: C11.A 64.77,39.37
VUSB
  Top 1.27: VUSB.1 +.1

### Text on the board
tPlace: prg Mode